# EAGLE design cuisine (EAGLE 8.6.3)
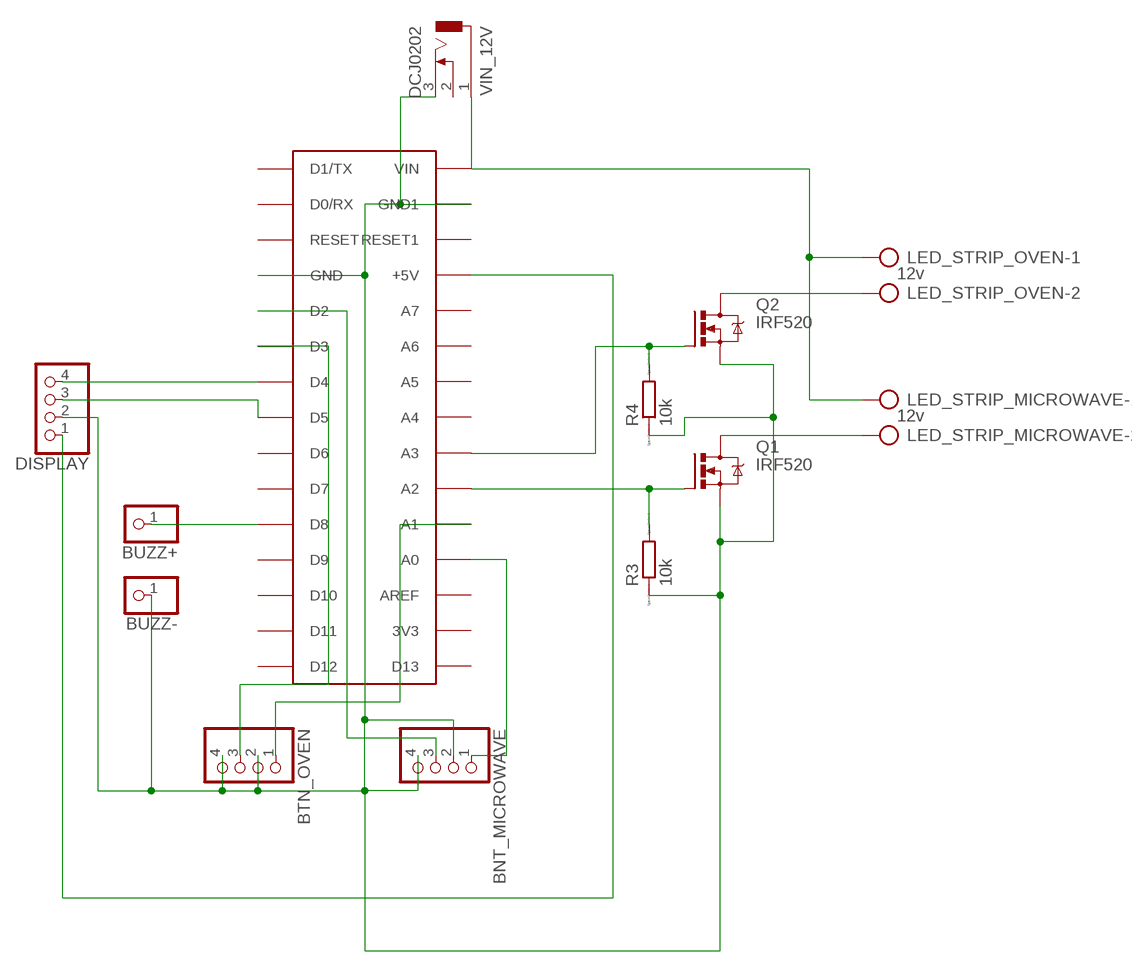
[diagram p0: schematic, sheet 1]

## Parts
BNT_MICROWAVE  PINHD-1X4  [1X04]
BTN_OVEN  PINHD-1X4  [1X04]
BUZZ+  PINHD-1X1  [1X01]
BUZZ-  PINHD-1X1  [1X01]
DISPLAY  PINHD-1X4  [1X04]
LED_STRIP_MICROWAVE  12v  AK500/2  [AK500/2]
LED_STRIP_OVEN  12v  AK500/2  [AK500/2]
NANO  ARDUINONANO  [PDIP-32]
Q1  IRF520  [TO220BV]
Q2  IRF520  [TO220BV]
R3  10k  R0204/7  [0204/7]
R4  10k  R0204/7  [0204/7]
VIN_12V  DCJ0202  [DCJ0202]

## Nets
N$1: BNT_MICROWAVE.1 NANO.A0
N$3: BNT_MICROWAVE.3 NANO.D2
N$4: BTN_OVEN.1 NANO.A1
N$5: BNT_MICROWAVE.2 BNT_MICROWAVE.4 BTN_OVEN.2 BTN_OVEN.4 BUZZ-.1 DISPLAY.2 NANO.GND NANO.GND1 Q1.S Q2.S R3.1 R4.1 VIN_12V.3
N$6: BTN_OVEN.3 NANO.D3
N$7: NANO.A2 Q1.G R3.2
N$8: DISPLAY.1 NANO.+5V
N$9: DISPLAY.4 NANO.D4
N$10: DISPLAY.3 NANO.D5
N$11: LED_STRIP_MICROWAVE.2 Q1.D
N$12: NANO.A3 Q2.G R4.2
N$13: LED_STRIP_MICROWAVE.1 LED_STRIP_OVEN.1 NANO.VIN VIN_12V.1
N$15: LED_STRIP_OVEN.2 Q2.D
N$16: BUZZ+.1 NANO.D8
Unconnected: NANO.3V3 NANO.A4 NANO.A5 NANO.A6 NANO.A7 NANO.AREF NANO.D0/RX NANO.D1/TX NANO.D6 NANO.D7 NANO.D9 NANO.D10 NANO.D11 NANO.D12 NANO.D13 NANO.RESET NANO.RESET1 VIN_12V.2

## Library data of the parts
BNT_MICROWAVE BTN_OVEN DISPLAY = pinhead:PINHD-1X4: PIN HEADER
BUZZ+ BUZZ- = pinhead:PINHD-1X1: PIN HEADER
LED_STRIP_MICROWAVE LED_STRIP_OVEN = con-ptr500:AK500/2: CONNECTOR; OC_FARNELL: unknown; OC_NEWARK: unknown
NANO = arduino-nano:ARDUINONANO
Q1 Q2 = transistor-power:IRF520: HEXFET Power MOSFET
R3 R4 = eagle-ltspice:R: RESISTOR, European symbol; SPICEMODEL: NONE; SPICEPREFIX: R
VIN_12V = con-jack:DCJ0202: DC POWER JACK Source: DCJ0202.pdf; OC_FARNELL: unknown; OC_NEWARK: unknown

## Board
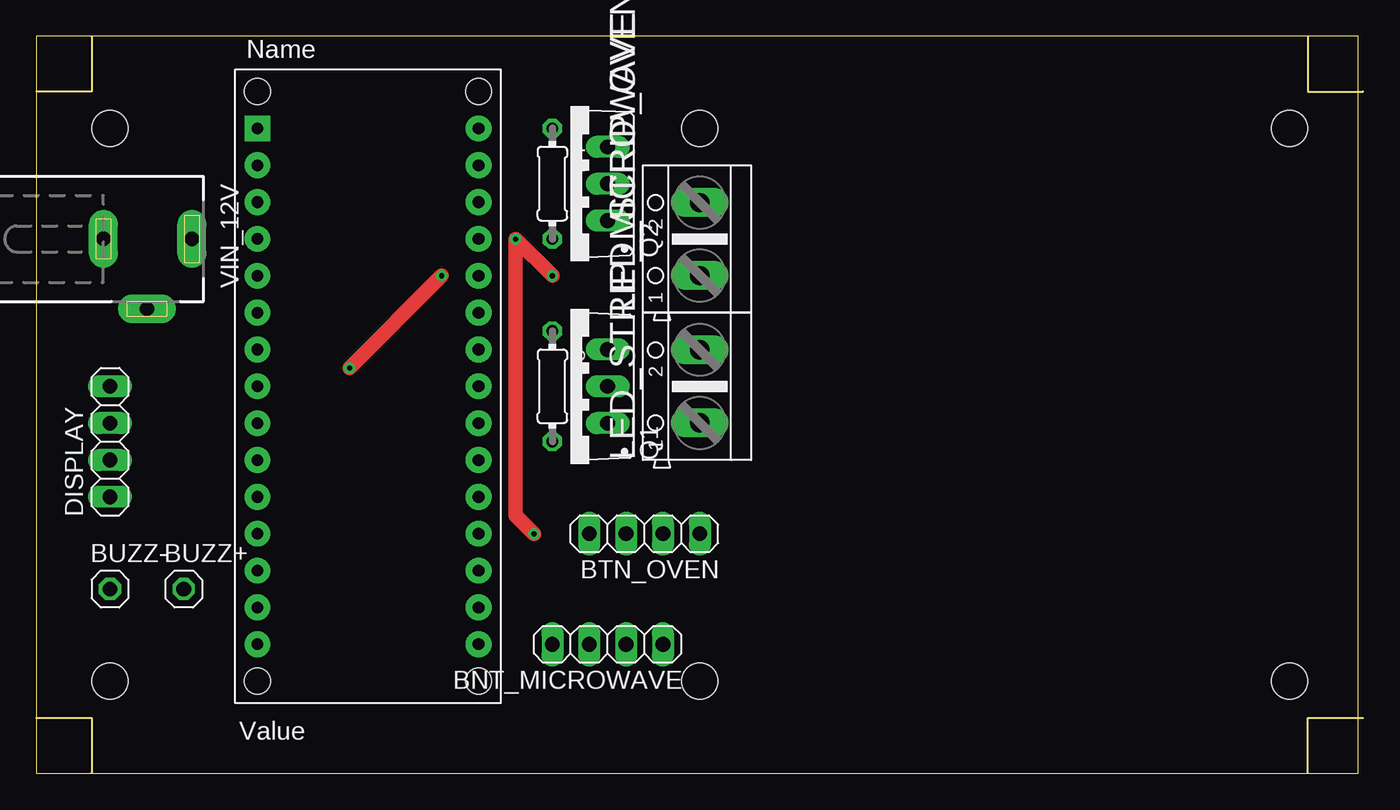
[diagram p1: board, top side]
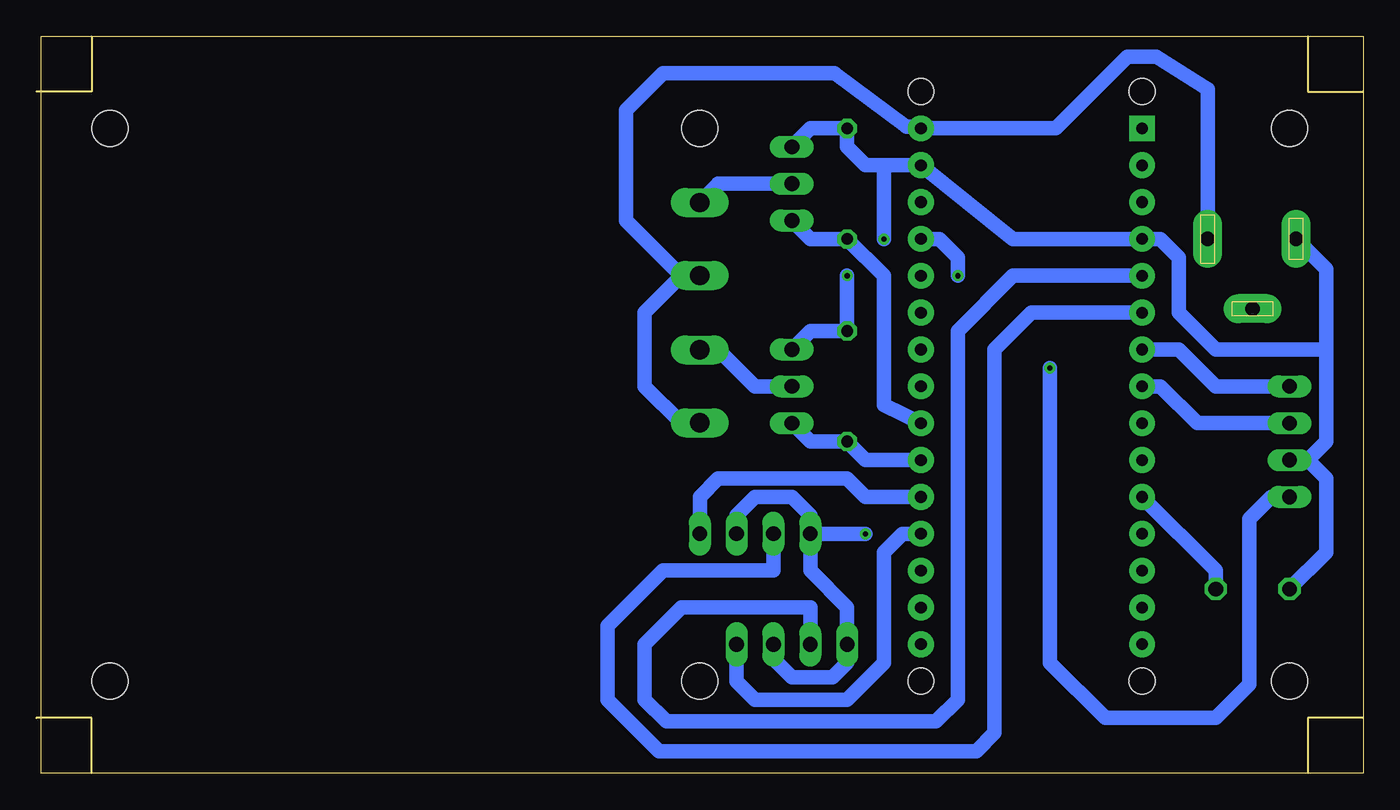
[diagram p2: board, bottom side, seen from below]

Size 91.44 x 50.8 mm. Coordinates in mm from the lower left corner, seen from the top.
Outline: 3.81,0 0,0 0,3.81
Outline: 3.81,0 87.63,0
Outline: 87.63,0 91.11,0 91.11,50.79 0,50.79 0,46.99
Outline: 0,46.99 0,3.81
Outline: 3.81,50.8 3.81,46.99 0,46.99
Outline: 87.63,50.8 87.63,46.99 91.44,46.99
Outline: 87.63,0 87.63,3.81 91.44,3.81
Outline: 0,3.81 3.81,3.81 3.81,0
Copper layers (1*16): Top 0.035mm / dielectric 1.5mm / Bottom 0.035mm
Design rules "default": minimum track width 6mil, minimum drill 0.35mm, track to track 6mil, track to pad 6mil, pad to pad 6mil, via to via 6mil, smd to smd 6mil, copper to edge 40mil, drill to drill 6mil, minimum pad ring 10mil, minimum via ring 8mil, stop-mask expansion 4mil, vias tented up to drill 0mil, thermal gap 10mil
Holes 2.5 mm at 5.08,44.45 5.08,6.35 86.36,6.35 86.36,44.45 45.72,44.45 45.72,6.35

### Footprints (pad centres in the part's own frame; a part is rotated, then mirrored left to right if it is on the bottom)
1X04 = drill 1.016 long: 1 -3.81,0; 2 -1.27,0; 3 1.27,0; 4 3.81,0
1X01 = drill 1.016 octagon: 1 0,0
AK500/2 = drill 1.321 long: 1 -2.515,0; 2 2.515,0
PDIP-32 = drill 0.8 pad 1.778: 3V3 15.24,-35.56; +5V 15.24,-10.16; A0 15.24,-30.48; A1 15.24,-27.94; A2 15.24,-25.4; A3 15.24,-22.86; A4 15.24,-20.32; A5 15.24,-17.78; A6 15.24,-15.24; A7 15.24,-12.7; AREF 15.24,-33.02; D0/RX 0,-5.08; D2 0,-12.7; D3 0,-15.24; D4 0,-17.78; D5 0,-20.32; D6 0,-22.86; D7 0,-25.4; D8 0,-27.94; D9 0,-30.48; D10 0,-33.02; D11 0,-35.56; D12 0,-38.1; D13 15.24,-38.1; GND 0,-10.16; GND1 15.24,-5.08; RESET 0,-7.62; RESET1 15.24,-7.62; VIN 15.24,-2.54 | drill 0.8 pad 1.778 square: D1/TX 0,-2.54 | hole 1.778: 0,0; 0,-40.64; 15.24,-40.64; 15.24,0
TO220BV = drill 1.016 long: D 0,-2.54; G -2.54,-2.54; S 2.54,-2.54
0204/7 = drill 0.813 octagon: 1 -3.81,0; 2 3.81,0
DCJ0202 = drill 1 pad 2 long: 1 0,3.1; 2 4.8,0; 3 0,-3

### Placement (x,y rotation side)
BNT_MICROWAVE  39.37,8.89 180 top
BTN_OVEN  41.91,16.51 180 top
BUZZ+  10.16,12.7 0 top
BUZZ-  5.08,12.7 0 top
DISPLAY  5.08,22.86 90 top
LED_STRIP_MICROWAVE  45.72,26.67 90 top
LED_STRIP_OVEN  45.72,36.83 90 top
NANO  15.24,46.99 0 top
Q1  36.83,26.67 90 top
Q2  36.83,40.64 90 top
R3  35.56,26.67 270 top
R4  35.56,40.64 270 top
VIN_12V  7.62,36.83 270 top

### Tracks (layer width: path | path; a pad name or v marks a point on that pad's centre or on a via)
N$1
  Bottom 1.016: BNT_MICROWAVE.1 43.18,6.35 41.91,5.08 35.56,5.08 33.02,7.62 33.02,15.24 31.75,16.51 NANO.A0
N$3
  Bottom 1.016: BNT_MICROWAVE.3 38.1,11.43 46.99,11.43 49.53,8.89 49.53,5.08 48.03,3.58 29.44,3.58 27.94,5.08 27.94,30.48 24.13,34.29 NANO.D2
N$4
  Bottom 1.016: NANO.A1 34.29,19.05 35.56,20.32 44.45,20.32 45.72,19.05 BTN_OVEN.1
N$5  (via drill 0.35)
  Top 1.016: v35.56,34.29 v33.02,36.83 33.02,17.78 v34.29,16.51
  Bottom 1.016: BNT_MICROWAVE.2 40.64,7.87 39.37,6.6 36.58,6.6 35.56,7.62 BNT_MICROWAVE.4 35.56,11.43 38.1,13.97 BTN_OVEN.4 | VIN_12V.3 2.54,34.75 2.54,29.21 | 3.81,21.59 2.54,22.86 2.54,29.21 | 3.81,21.59 DISPLAY.2 | Q1.S 38.1,30.48 R3.1 v35.56,34.29 | Q2.S 38.1,44.45 R4.1 35.56,43.18 34.29,41.91 33.02,41.91 | 33.02,41.91 NANO.GND1 24.13,36.83 NANO.GND 13.97,36.83 12.7,35.56 12.7,31.75 10.16,29.21 2.54,29.21 | BUZZ-.1 2.54,15.24 2.54,20.32 3.81,21.59 | v33.02,36.83 33.02,41.91 | BTN_OVEN.2 43.18,17.78 41.91,19.05 39.37,19.05 38.1,17.78 BTN_OVEN.4 | BTN_OVEN.4 v34.29,16.51
N$6
  Bottom 1.016: BTN_OVEN.3 40.64,13.97 48.26,13.97 52.07,10.16 52.07,5.08 48.51,1.52 26.67,1.52 25.4,2.79 25.4,29.21 22.86,31.75 NANO.D3
N$7
  Bottom 1.016: Q1.G 38.1,22.86 R3.2 34.29,21.59 NANO.A2
N$8  (via drill 0.35)
  Top 1.016: v21.59,27.94 v27.94,34.29
  Bottom 1.016: DISPLAY.1 6.35,19.05 7.85,17.55 7.85,6.12 10.16,3.81 17.78,3.81 21.59,7.62 v21.59,27.94 | v27.94,34.29 27.94,35.56 29.21,36.83 NANO.+5V
N$9
  Bottom 1.016: DISPLAY.4 10.16,26.67 12.7,29.21 NANO.D4
N$10
  Bottom 1.016: DISPLAY.3 11.43,24.13 13.97,26.67 NANO.D5
N$11
  Bottom 1.016: Q1.D 41.91,26.67 44.45,29.21 45.7,29.21 LED_STRIP_MICROWAVE.2
N$12
  Bottom 1.016: Q2.G 38.1,36.83 R4.2 33.02,34.29 33.02,25.4 NANO.A3
N$13
  Bottom 1.016: LED_STRIP_OVEN.1 46.97,34.31 | LED_STRIP_MICROWAVE.1 45.74,24.13 46.99,24.13 49.53,26.67 49.53,31.75 46.97,34.31 | VIN_12V.1 10.72,47.15 14.24,49.4 16.24,49.4 21.19,44.45 NANO.VIN 30.61,44.58 31.48,44.58 36.43,48.26 48.26,48.26 50.8,45.72 50.8,38.1 47.02,34.31 46.97,34.31
N$15
  Bottom 1.016: LED_STRIP_OVEN.2 44.45,40.62 44.45,40.64 Q2.D
N$16
  Bottom 1.016: BUZZ+.1 10.16,13.97 NANO.D8